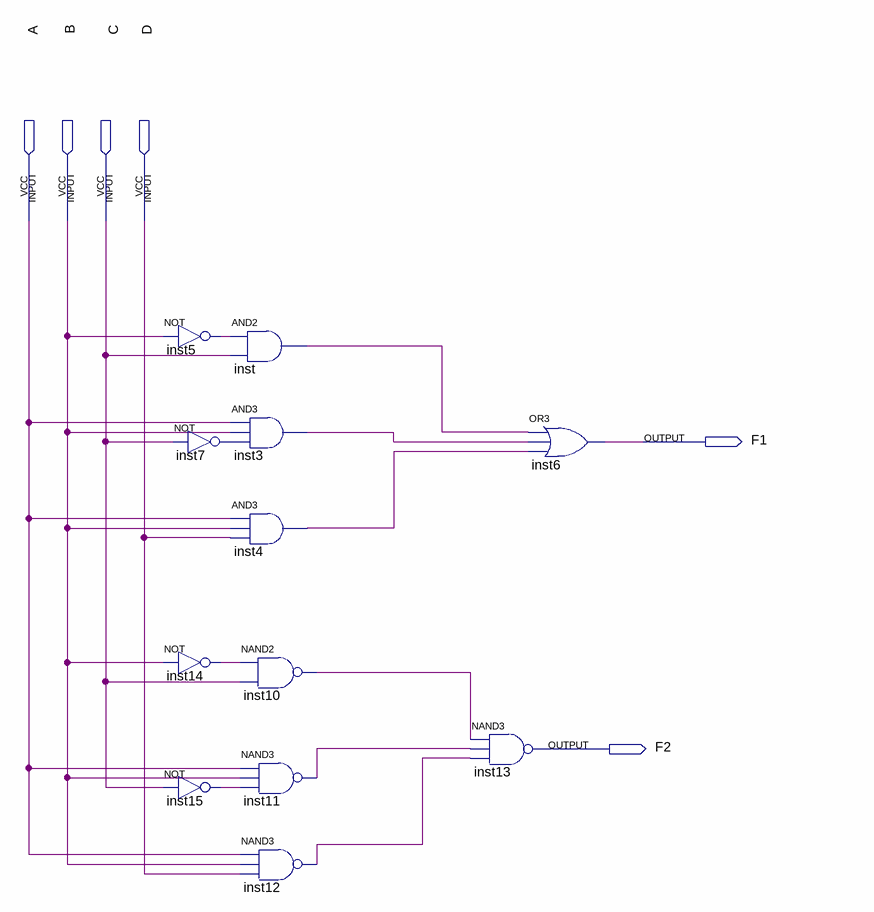
[diagram p0: schematic sheet]
// Quartus schematic HW3P2.bdf as structural Verilog: 12 symbols, 6 pins
module HW3P2 (
  input  A,
  input  B,
  input  C,
  input  D,
  output F1,
  output F2
);

  wire inst3_out, inst4_out, inst5_out, inst7_out, inst10_out, inst11_out, inst12_out, inst14_out,
       inst15_out, inst_out;

  not inst5 (inst5_out, B);
  not inst7 (inst7_out, C);
  not inst14 (inst14_out, B);
  not inst15 (inst15_out, C);
  and inst (inst_out, inst5_out, C);
  and inst3 (inst3_out, A, B, inst7_out);
  and inst4 (inst4_out, A, B, D);
  nand inst10 (inst10_out, inst14_out, C);
  nand inst11 (inst11_out, A, B, inst15_out);
  nand inst12 (inst12_out, A, B, D);
  nand inst13 (F2, inst10_out, inst11_out, inst12_out);
  or inst6 (F1, inst_out, inst3_out, inst4_out);
endmodule
